# EAGLE design driver_power_AC (EAGLE 9.6.2)
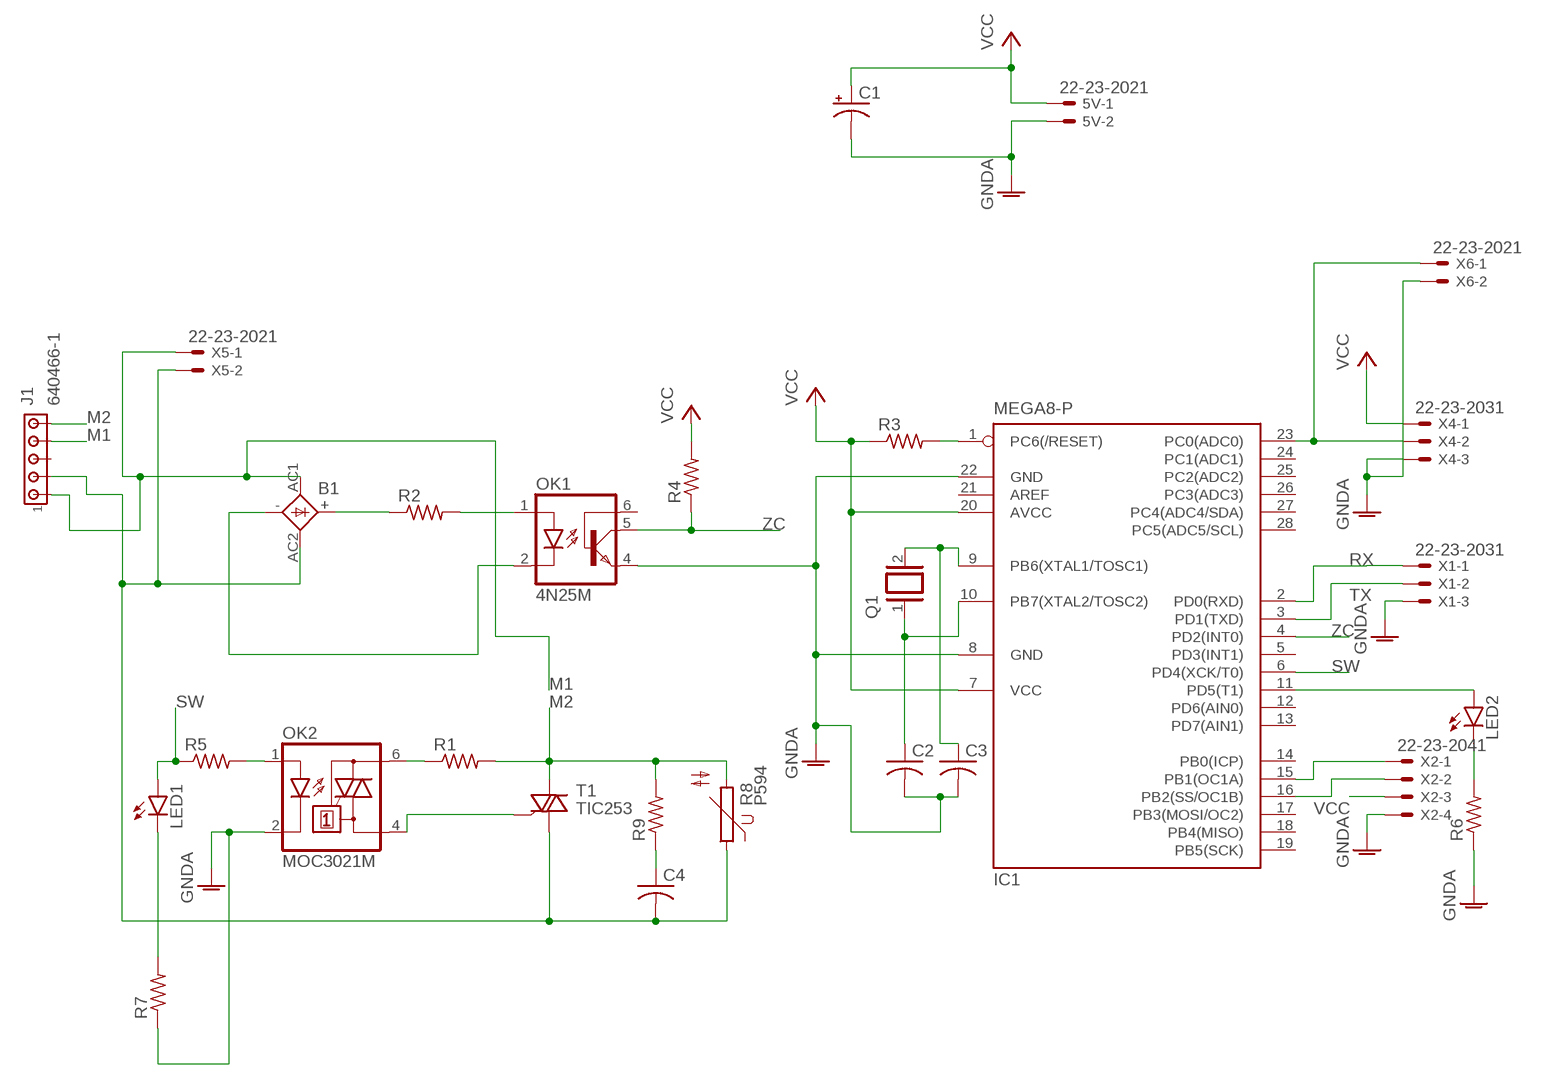
[diagram p0: schematic, sheet 1]

## Parts
5V  22-23-2021  [22-23-2021]
B1  SKB  [SKB]
C1  CPOL-USE5-10.5  [E5-10,5]
C2  C-US025-025X050  [C025-025X050]
C3  C-US025-025X050  [C025-025X050]
C4  C-US050-025X075  [C050-025X075]
IC1  MEGA8-P  [DIL28-3]
J1  640466-1  [640466-1]
LED1  LED3MM  [LED3MM]
LED2  LED3MM  [LED3MM]
OK1  4N25M  [DIL06]
OK2  MOC3021M  [DIL06]
Q1  XTAL/S  [QS]
R1  R-US_0411/12  [0411/12]
R2  R-US_0617/22  [0617/22]
R3  R-US_0204/7  [0204/7]
R4  R-US_0207/10  [0207/10]
R5  R-US_0207/10  [0207/10]
R6  R-US_0207/10  [0207/10]
R7  R-US_0207/10  [0207/10]
R8  P594  [P594]
R9  R-US_0207/7  [0207/7]
T1  TIC253  [TO218DS]
X1  22-23-2031  [22-23-2031]
X2  22-23-2041  [22-23-2041]
X4  22-23-2031  [22-23-2031]
X5  22-23-2021  [22-23-2021]
X6  22-23-2021  [22-23-2021]

## Nets
GNDA: 5V.2 C1.- C2.2 C3.2 IC1.8(GND) IC1.22(GND) OK1.4(EMI) OK2.2(C) R6.1 R7.1 X1.3 X2.4 X4.3 X6.2
M1: B1.AC1 J1.1 J1.4 X5.1
M2: J1.5 R1.2 R8.2 R9.2 T1.A2
N$1: IC1.15(PB1(OC1A)) X2.1
N$2: OK2.6(A2) R1.1
N$3: OK1.1(A) R2.2
N$4: OK2.4(A1) T1.G
N$5: B1.+ R2.1
N$6: B1.- OK1.2(C)
N$7: B1.AC2 C4.2 J1.2 R8.1 T1.A1 X5.2
N$8: IC1.16(PB2(SS/OC1B)) X2.2
N$9: IC1.11(PD5(T1)) LED2.A
N$10: LED1.K(C) R7.2
N$11: IC1.1(PC6(/RESET)) R3.2
N$12: IC1.23(PC0(ADC0)) X4.2 X6.1
N$13: OK2.1(A) R5.2
N$14: LED2.K(C) R6.2
N$15: C3.1 IC1.9(PB6(XTAL1/TOSC1)) Q1.2
N$16: C2.1 IC1.10(PB7(XTAL2/TOSC2)) Q1.1
N$17: C4.1 R9.1
RX: IC1.2(PD0(RXD)) X1.1
SW: IC1.6(PD4(XCK/T0)) LED1.A R5.1
TX: IC1.3(PD1(TXD)) X1.2
VCC: 5V.1 C1.+ IC1.7(VCC) IC1.20(AVCC) R3.1 R4.2 X2.3 X4.1
ZC: IC1.4(PD2(INT0)) OK1.5(COL) R4.1
Unconnected: IC1.5(PD3(INT1)) IC1.12(PD6(AIN0)) IC1.13(PD7(AIN1)) IC1.14(PB0(ICP)) IC1.17(PB3(MOSI/OC2)) IC1.18(PB4(MISO)) IC1.19(PB5(SCK)) IC1.21(AREF) IC1.24(PC1(ADC1)) IC1.25(PC2(ADC2)) IC1.26(PC3(ADC3)) IC1.27(PC4(ADC4/SDA)) IC1.28(PC5(ADC5/SCL)) J1.3 OK1.6(BAS)

## Library data of the parts
5V X5 X6 = con-molex:22-23-2021: .100" (2.54mm) Center Header - 2 Pin; MF: MOLEX; MPN: 22-23-2021; OC_FARNELL: 1462926; OC_NEWARK: 25C3832
B1 = rectifier:SKB: SEMIKRON RECTIFIER
C1 = rcl:CPOL-US: POLARIZED CAPACITOR, American symbol; SPICEPREFIX: C
C2-C4 = rcl:C-US: CAPACITOR, American symbol; SPICEPREFIX: C
IC1 = atmel:MEGA8-P: MICROCONTROLLER 8 Kbytes FLASH, 1 kbytes SRAM, 512 bytes EEPROM, USART, 4-channel 10 bit ADC, 2-channel 8 bit ADC Pin compatible with Atmega48, ATMega88, ATMega168 Source: avr.lbr; OC_FARNELL: unknown; OC_NEWARK: unknown
J1 = con-amp:640466-1: Universal MATE-N-LOK .250" Centerline, 600 V, 19 - 36 A max Source: http://catalog.tycoelectronics.com/ .. ENG_CD_640466_M.pdf
LED1 LED2 = led:LED: LED OSRAM: - CHIPLED LG R971, LG N971, LY N971, LG Q971, LY Q971, LO R971, LY R971 LH N974, LH R974 LS Q976, LO Q976, LY Q976 LO Q996 - Hyper CHIPLED LW Q18S LB Q993, LB Q99A, LB R99A - SideLED LS A670, LO A670, LY A670, LG A670, LP A670 LB A673, LV A673, LT A673, LW A673 LH A674 LY A675 LS A676, LA A676, LO A676, LY A676, LW A676 LS A679, LY A679, LG A679 - Hyper Micro SIDELED® LS Y876, LA Y876, LO Y876, LY Y876 LT Y87S - SmartLED LW L88C, LW L88S LB L89C, LB L89S, LG L890 LS L89K, LO L89K, LY L89K LS L896, LA L896, LO L896, LY L896 - TOPLED LS T670, LO T670, LY T670, LG T670, LP T670 LSG T670, LSP T670, LSY T670, LOP T670, LYG T670 LG T671, LOG T671, LSG T671 LB T673, LV T673, LT T673, LW T673 LH T674 LS T676, LA T676, LO T676, LY T676, LB T676, LH T676, LSB T676, LW T676 LB T67C, LV T67C, LT T67C, LS T67K, LO T67K, LY T67K, LW E67C LS E67B, LA E67B, LO E67B, LY E67B, LB E67C, LV E67C, LT E67C LW T67C LS T679, LY T679, LG T679 LS T770, LO T770, LY T770, LG T770, LP T770 LB T773, LV T773, LT T773, LW T773 LH T774 LS E675, LA E675, LY E675, LS T675 LS T776, LA T776, LO T776, LY T776, LB T776 LHGB T686 LT T68C, LB T68C - Hyper Mini TOPLED® LB M676 - Mini TOPLED Santana® LG M470 LS M47K, LO M47K, LY M47K Source: http://www.osram.convergy.de LUXEON: - LUMILED® LXK2-PW12-R00, LXK2-PW12-S00, LXK2-PW14-U00, LXK2-PW14-V00 LXK2-PM12-R00, LXK2-PM12-S00, LXK2-PM14-U00 LXK2-PE12-Q00, LXK2-PE12-R00, LXK2-PE12-S00, LXK2-PE14-T00, LXK2-PE14-U00 LXK2-PB12-K00, LXK2-PB12-L00, LXK2-PB12-M00, LXK2-PB14-N00, LXK2-PB14-P00, LXK2-PB14-Q00 LXK2-PR12-L00, LXK2-PR12-M00, LXK2-PR14-Q00, LXK2-PR14-R00 LXK2-PD12-Q00, LXK2-PD12-R00, LXK2-PD12-S00 LXK2-PH12-R00, LXK2-PH12-S00 LXK2-PL12-P00, LXK2-PL12-Q00, LXK2-PL12-R00 Source: www.luxeon.com KINGBRIGHT: KA-3528ASYC Source: www.kingbright.com
OK1 = optocoupler:4N*?M: General Purpose 6-Pin Phototransistor Optocouplers Source: http://www.fairchildsemi.com/ds/4N/4N35-M.pdf; MPN: 4N25-M; OC_FARNELL: 1021349; OC_NEWARK: 98K9084
OK2 = optocoupler:MOC30*M: RANDOM-PHASE OPTOISOLATORS TRIAC DRIVER OUTPUT Source: http://www.fairchildsemi.com MOC3020-M.pdf; MF: FAIRCHILD SEMICONDUCTOR; MPN: MOC3021-M; OC_FARNELL: 1021365; OC_NEWARK: 95B7895
Q1 = special:XTAL/S: CRYSTAL
R1-R7 R9 = rcl:R-US_: RESISTOR, American symbol; SPICEPREFIX: R
R8 = varistor:P594: VARISTOR
T1 = triac:TIC253: TRIAC
X1 X4 = con-molex:22-23-2031: .100" (2.54mm) Center Header - 3 Pin; MF: MOLEX; MPN: 22-23-2031; OC_FARNELL: 1462950; OC_NEWARK: 30C0862
X2 = con-molex:22-23-2041: .100" (2.54mm) Center Header - 4 Pin; MF: MOLEX; MPN: 22-23-2041; OC_FARNELL: 1462920; OC_NEWARK: 38C0355

## Board
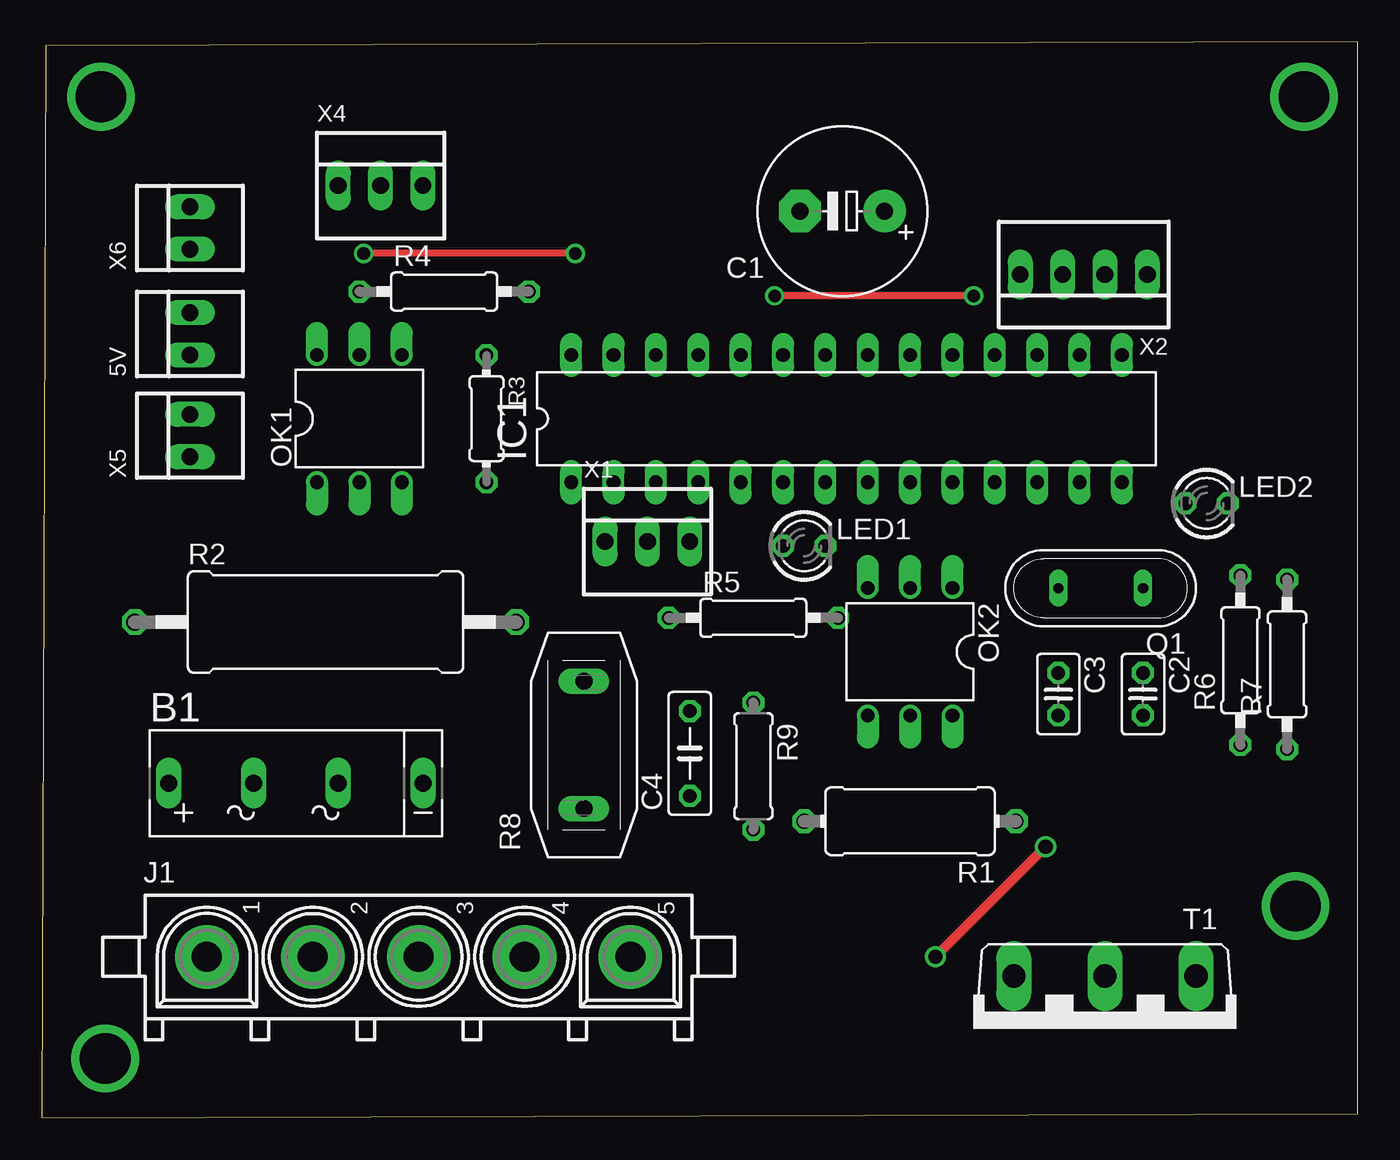
[diagram p1: board, top side]
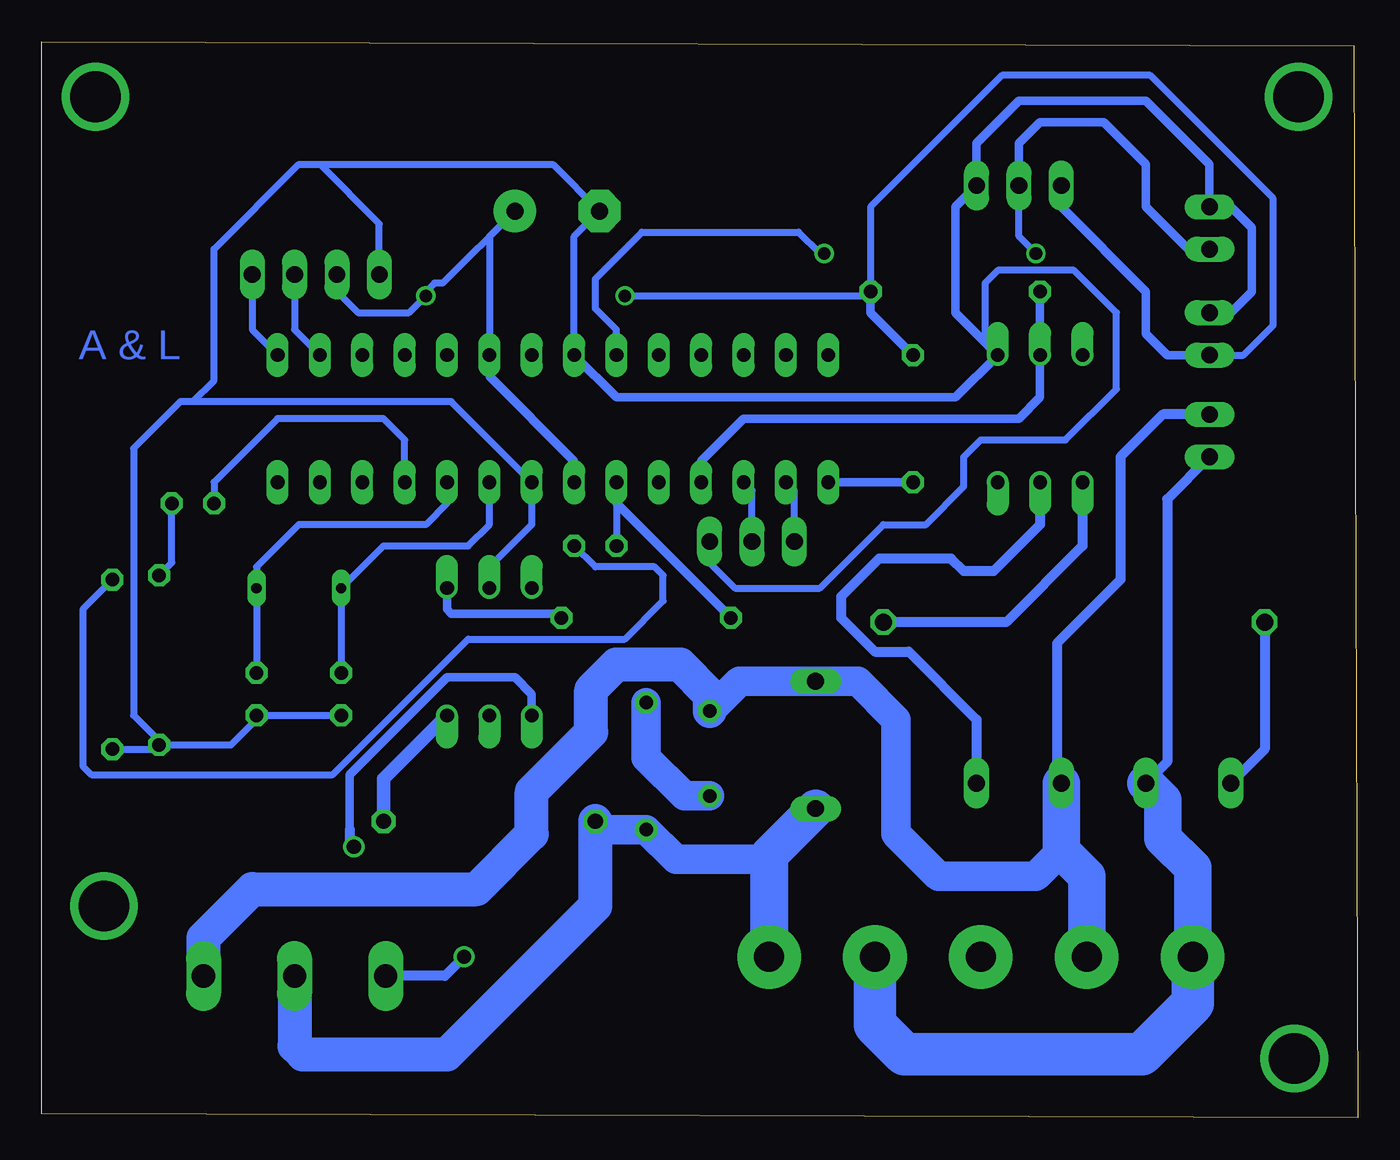
[diagram p2: board, bottom side, seen from below]

Size 78.92 x 64.51 mm. Coordinates in mm from the lower left corner, seen from the top.
Outline: 0,0 78.92,0.25 78.92,64.51 0.25,64.25 0,0
Copper layers (1*16): Top 0.035mm / dielectric 1.5mm / Bottom 0.035mm
Design rules "default": minimum track width 6mil, minimum drill 0.35mm, track to track 6mil, track to pad 6mil, pad to pad 6mil, via to via 6mil, smd to smd 6mil, copper to edge 40mil, drill to drill 6mil, minimum pad ring 10mil, minimum via ring 8mil, stop-mask expansion 4mil, vias tented up to drill 0mil, thermal gap 10mil

### Footprints (pad centres in the part's own frame; a part is rotated, then mirrored left to right if it is on the bottom)
22-23-2021 = drill 1 long: 1 -1.27,0; 2 1.27,0
SKB = drill 1.016 long: + -7.62,0; - 7.62,0; AC1 -2.54,0; AC2 2.54,0
E5-10,5 = drill 1.016 pad 2.54: + -2.54,0 | drill 1.016 pad 2.54 octagon: - 2.54,0
C025-025X050 = drill 0.813 octagon: 1 -1.27,0; 2 1.27,0
C050-025X075 = drill 0.813 octagon: 1 -2.54,0; 2 2.54,0
DIL28-3 = drill 0.813 long: 1 -16.51,-3.81; 2 -13.97,-3.81; 3 -11.43,-3.81; 4 -8.89,-3.81; 5 -6.35,-3.81; 6 -3.81,-3.81; 7 -1.27,-3.81; 8 1.27,-3.81; 9 3.81,-3.81; 10 6.35,-3.81; 11 8.89,-3.81; 12 11.43,-3.81; 13 13.97,-3.81; 14 16.51,-3.81; 15 16.51,3.81; 16 13.97,3.81; 17 11.43,3.81; 18 8.89,3.81; 19 6.35,3.81; 20 3.81,3.81; 21 1.27,3.81; 22 -1.27,3.81; 23 -3.81,3.81; 24 -6.35,3.81; 25 -8.89,3.81; 26 -11.43,3.81; 27 -13.97,3.81; 28 -16.51,3.81
640466-1 = drill 1.8 pad 3.81: 1 -12.7,0; 2 -6.35,0; 3 0,0; 4 6.35,0; 5 12.7,0
LED3MM = drill 0.813 octagon: A -1.27,0; K 1.27,0
DIL06 = drill 0.813 offset: 1 -2.54,-3.81; 2 0,-3.81; 3 2.54,-3.81; 4 2.54,3.81; 5 0,3.81; 6 -2.54,3.81
QS = drill 0.61 long: 1 -2.54,0; 2 2.54,0
0411/12 = drill 0.914 octagon: 1 -6.35,0; 2 6.35,0
0617/22 = drill 1.016 octagon: 1 -11.43,0; 2 11.43,0
0204/7 = drill 0.813 octagon: 1 -3.81,0; 2 3.81,0
0207/10 = drill 0.813 octagon: 1 -5.08,0; 2 5.08,0
P594 = drill 1.016 long: 1 0,3.81; 2 0,-3.81
0207/7 = drill 0.813 octagon: 1 -3.81,0; 2 3.81,0
TO218DS = drill 1.397 long: A1 -5.461,-3.175; A2 0,-3.175; G 5.461,-3.175
22-23-2031 = drill 1 long: 1 -2.54,0; 2 0,0; 3 2.54,0
22-23-2041 = drill 1 long: 1 -3.81,0; 2 -1.27,0; 3 1.27,0; 4 3.81,0

### Placement (x,y rotation side)
5V  8.89,46.99 90 top
B1  15.24,20.07 0 top
C1  48.01,54.36 180 top
C2  66.04,25.4 270 top
C3  60.96,25.4 270 top
C4  38.86,21.84 90 top
IC1  48.26,41.91 0 top
J1  22.61,9.65 0 top
LED1  45.72,34.29 0 top
LED2  69.85,36.83 0 top
OK1  19.05,41.91 0 top
OK2  52.07,27.94 180 top
Q1  63.5,31.75 180 top
R1  52.07,17.78 180 top
R2  17.02,29.72 0 top
R3  26.67,41.91 270 top
R4  24.13,49.53 0 top
R5  42.67,29.97 0 top
R6  71.88,27.43 90 top
R7  74.68,27.18 90 top
R8  32.51,22.35 0 top
R9  42.67,21.08 270 top
T1  63.75,5.33 180 top
X1  36.32,34.54 0 top
X2  62.48,50.55 180 top
X4  20.32,55.88 0 top
X5  8.89,40.89 90 top
X6  8.89,53.34 90 top

### Tracks (layer width: path | path; a pad name or v marks a point on that pad's centre or on a via)
GNDA
  Bottom 0.406: OK2.2 52.07,33.02 49.53,35.56 IC1.8 54.36,42.93 69.85,42.93 | C2.2 65.79,24.13 | 65.79,24.13 C3.2 | R7.1 72.14,22.1 R6.1 71.63,22.35 | 71.63,22.35 67.56,22.35 65.79,24.13 | 69.85,42.93 70.61,42.93 73.41,40.13 73.41,24.13 71.63,22.35 | IC1.22 46.99,52.83 C1.- 48.26,57.15 62.23,57.15 | 69.85,42.93 68.58,44.2 68.58,52.07 63.5,57.15 62.23,57.15 | X2.4 58.67,53.59 62.23,57.15 | X1.3 38.86,33.27 37.34,31.75 32.26,31.75 28.45,35.56 25.91,35.56 23.62,37.85 23.62,39.62 22.61,40.64 17.53,40.64 14.48,43.69 14.48,48.26 17.02,50.8 21.59,50.8 22.35,50.04 22.35,46.48 21.84,45.97
  Bottom 0.508: 5V.2 7.62,48.26 6.35,49.53 6.35,53.34 7.62,54.61 X6.2 8.89,57.15 12.7,60.96 20.32,60.96 22.86,58.42 X4.3 24.13,54.61 24.13,48.26 21.84,45.97 OK1.4 24.13,43.18 44.45,43.18 IC1.22
M1
  Bottom 0.61: B1.AC1 11.43,21.34 11.43,37.08 X5.1
  Bottom 2.235: B1.AC1 11.68,19.05 11.68,16.76 9.91,14.99 J1.1
  Bottom 2.54: J1.4 28.96,5.59 27.18,3.81 12.95,3.81 9.91,6.86 J1.1
M2
  Bottom 1.778: 35.31,15.75 35.56,15.49 40.89,15.49 R9.2 45.21,17.27 R1.2
  Bottom 2.032: T1.A2 63.75,4.32 63.25,3.81 54.61,3.81 45.72,12.7 R1.2
  Bottom 2.286: R8.2 35.31,15.75 J1.5
N$1
  Bottom 0.406: X2.1 66.29,47.24 IC1.15
N$2
  Bottom 0.813: OK2.6 58.42,20.32 R1.1
N$3
  Bottom 0.61: OK1.1 16.51,34.29 21.08,29.72 R2.2
N$4  (via drill 0.85)
  Top 0.61: v60.2,16.26 v53.59,9.65
  Bottom 0.508: OK2.4 49.53,25.4 50.55,26.42 54.61,26.42 60.45,20.57 60.45,17.27
  Bottom 0.61: 60.45,17.27 60.45,16.51 v60.2,16.26 | v53.59,9.65 54.74,8.51 T1.G
N$5
  Bottom 0.61: R2.1 5.59,22.1 B1.+
N$6
  Bottom 0.61: OK1.2 19.05,35.56 21.84,32.77 23.62,32.77 24.38,33.53 28.7,33.53 30.99,31.24 30.99,29.97 28.96,27.94 26.92,27.94 22.86,23.88 B1.-
N$7
  Bottom 0.61: B1.AC2 18.03,20.32 18.03,28.45 14.22,32.26 14.22,39.62 11.68,42.16 X5.2
  Bottom 1.778: 17.78,16 19.3,14.48 25.15,14.48 27.69,17.02 27.69,23.88 29.97,26.16 R8.1 37.08,26.16 C4.2
  Bottom 2.032: T1.A1 69.22,10.79 66.29,13.72 52.83,13.72 49.53,17.02 49.53,19.56 45.97,23.11 45.97,25.65 44.45,27.18 40.64,27.18 38.86,25.4 C4.2
  Bottom 2.235: B1.AC2 17.78,16 16.26,14.48 J1.2
N$8
  Bottom 0.406: X2.2 63.75,47.24 IC1.16
N$9
  Bottom 0.406: IC1.11 57.15,40.64 58.42,41.91 64.77,41.91 68.58,38.1 LED2.A
N$10
  Bottom 0.406: R7.2 76.45,30.48 76.45,21.08 75.95,20.57 61.47,20.57 53.34,28.7 43.94,28.7 41.66,30.99 41.66,32.51 42.16,33.02 45.72,33.02 LED1.K
N$11
  Bottom 0.508: IC1.1 R3.2
N$12  (via drill 0.75)
  Top 0.406: v32,51.82 v19.3,51.82
  Bottom 0.406: IC1.23 44.45,47.24 45.72,48.51 45.72,50.29 42.93,53.09 33.53,53.09 32.26,51.82 v32,51.82 | v19.3,51.82 20.32,52.83 X4.2
  Bottom 0.508: X4.2 20.32,58.42 19.05,59.69 15.24,59.69 12.7,57.15 12.7,54.61 10.16,52.07 X6.1
N$13
  Bottom 0.508: OK2.1 54.61,30.48 54.36,30.23 48.01,30.23 R5.2
N$14
  Bottom 0.406: R6.2 71.12,33.27 LED2.K
N$15
  Bottom 0.406: IC1.9 52.07,35.56 53.34,34.29 58.42,34.29 Q1.2 C3.1
N$16
  Bottom 0.406: IC1.10 54.61,36.83 55.88,35.56 63.5,35.56 66.04,33.02 Q1.1 C2.1
N$17
  Bottom 1.778: C4.1 40.39,19.3 42.67,21.59 R9.1
N$18  (via drill 3.05)
  other vias: 3.56,61.21
N$19  (via drill 3.05)
  other vias: 75.69,61.21
N$20  (via drill 3.05)
  other vias: 75.18,12.7
N$21  (via drill 3.05)
  other vias: 3.81,3.56
RX
  Bottom 0.406: X1.1 33.78,37.59 IC1.2
SW
  Bottom 0.406: IC1.6 LED1.A
  Bottom 0.508: IC1.6 44.45,36.83 R5.1
TX
  Bottom 0.406: X1.2 36.32,37.59 IC1.3
VCC  (via drill 0.75)
  Top 0.406: v55.88,49.28 v43.94,49.28
  Bottom 0.406: IC1.20 52.07,52.83 C1.+ 54.86,50.04 55.37,50.04 55.88,49.53 v55.88,49.28 56.9,48.26 59.94,48.26 61.21,49.53 X2.3 | 5V.1 6.86,45.72 5.08,47.5 5.08,55.12 12.45,62.48 21.34,62.48 29.21,54.61 R4.2 29.46,49.28 v43.94,49.28
  Bottom 0.508: X4.1 17.78,54.61 12.7,49.53 12.7,46.99 11.43,45.72 5V.1 | R3.1 29.21,48.26 R4.2 | IC1.7 46.99,39.37 52.07,44.45 IC1.20
ZC
  Bottom 0.508: R4.1 OK1.5 19.05,43.18 20.32,41.91 36.83,41.91 39.37,39.37 IC1.4

### Text on the board
Bottom: A & L